# EasyEDA schematic SCH_FC-ESP32_2026-02-12.json
TITLE: Sheet_1; REV: 1.0; Date: 2026-01-28; Sheet: 1/1; Drawn By: ommulik; Company: Your Company
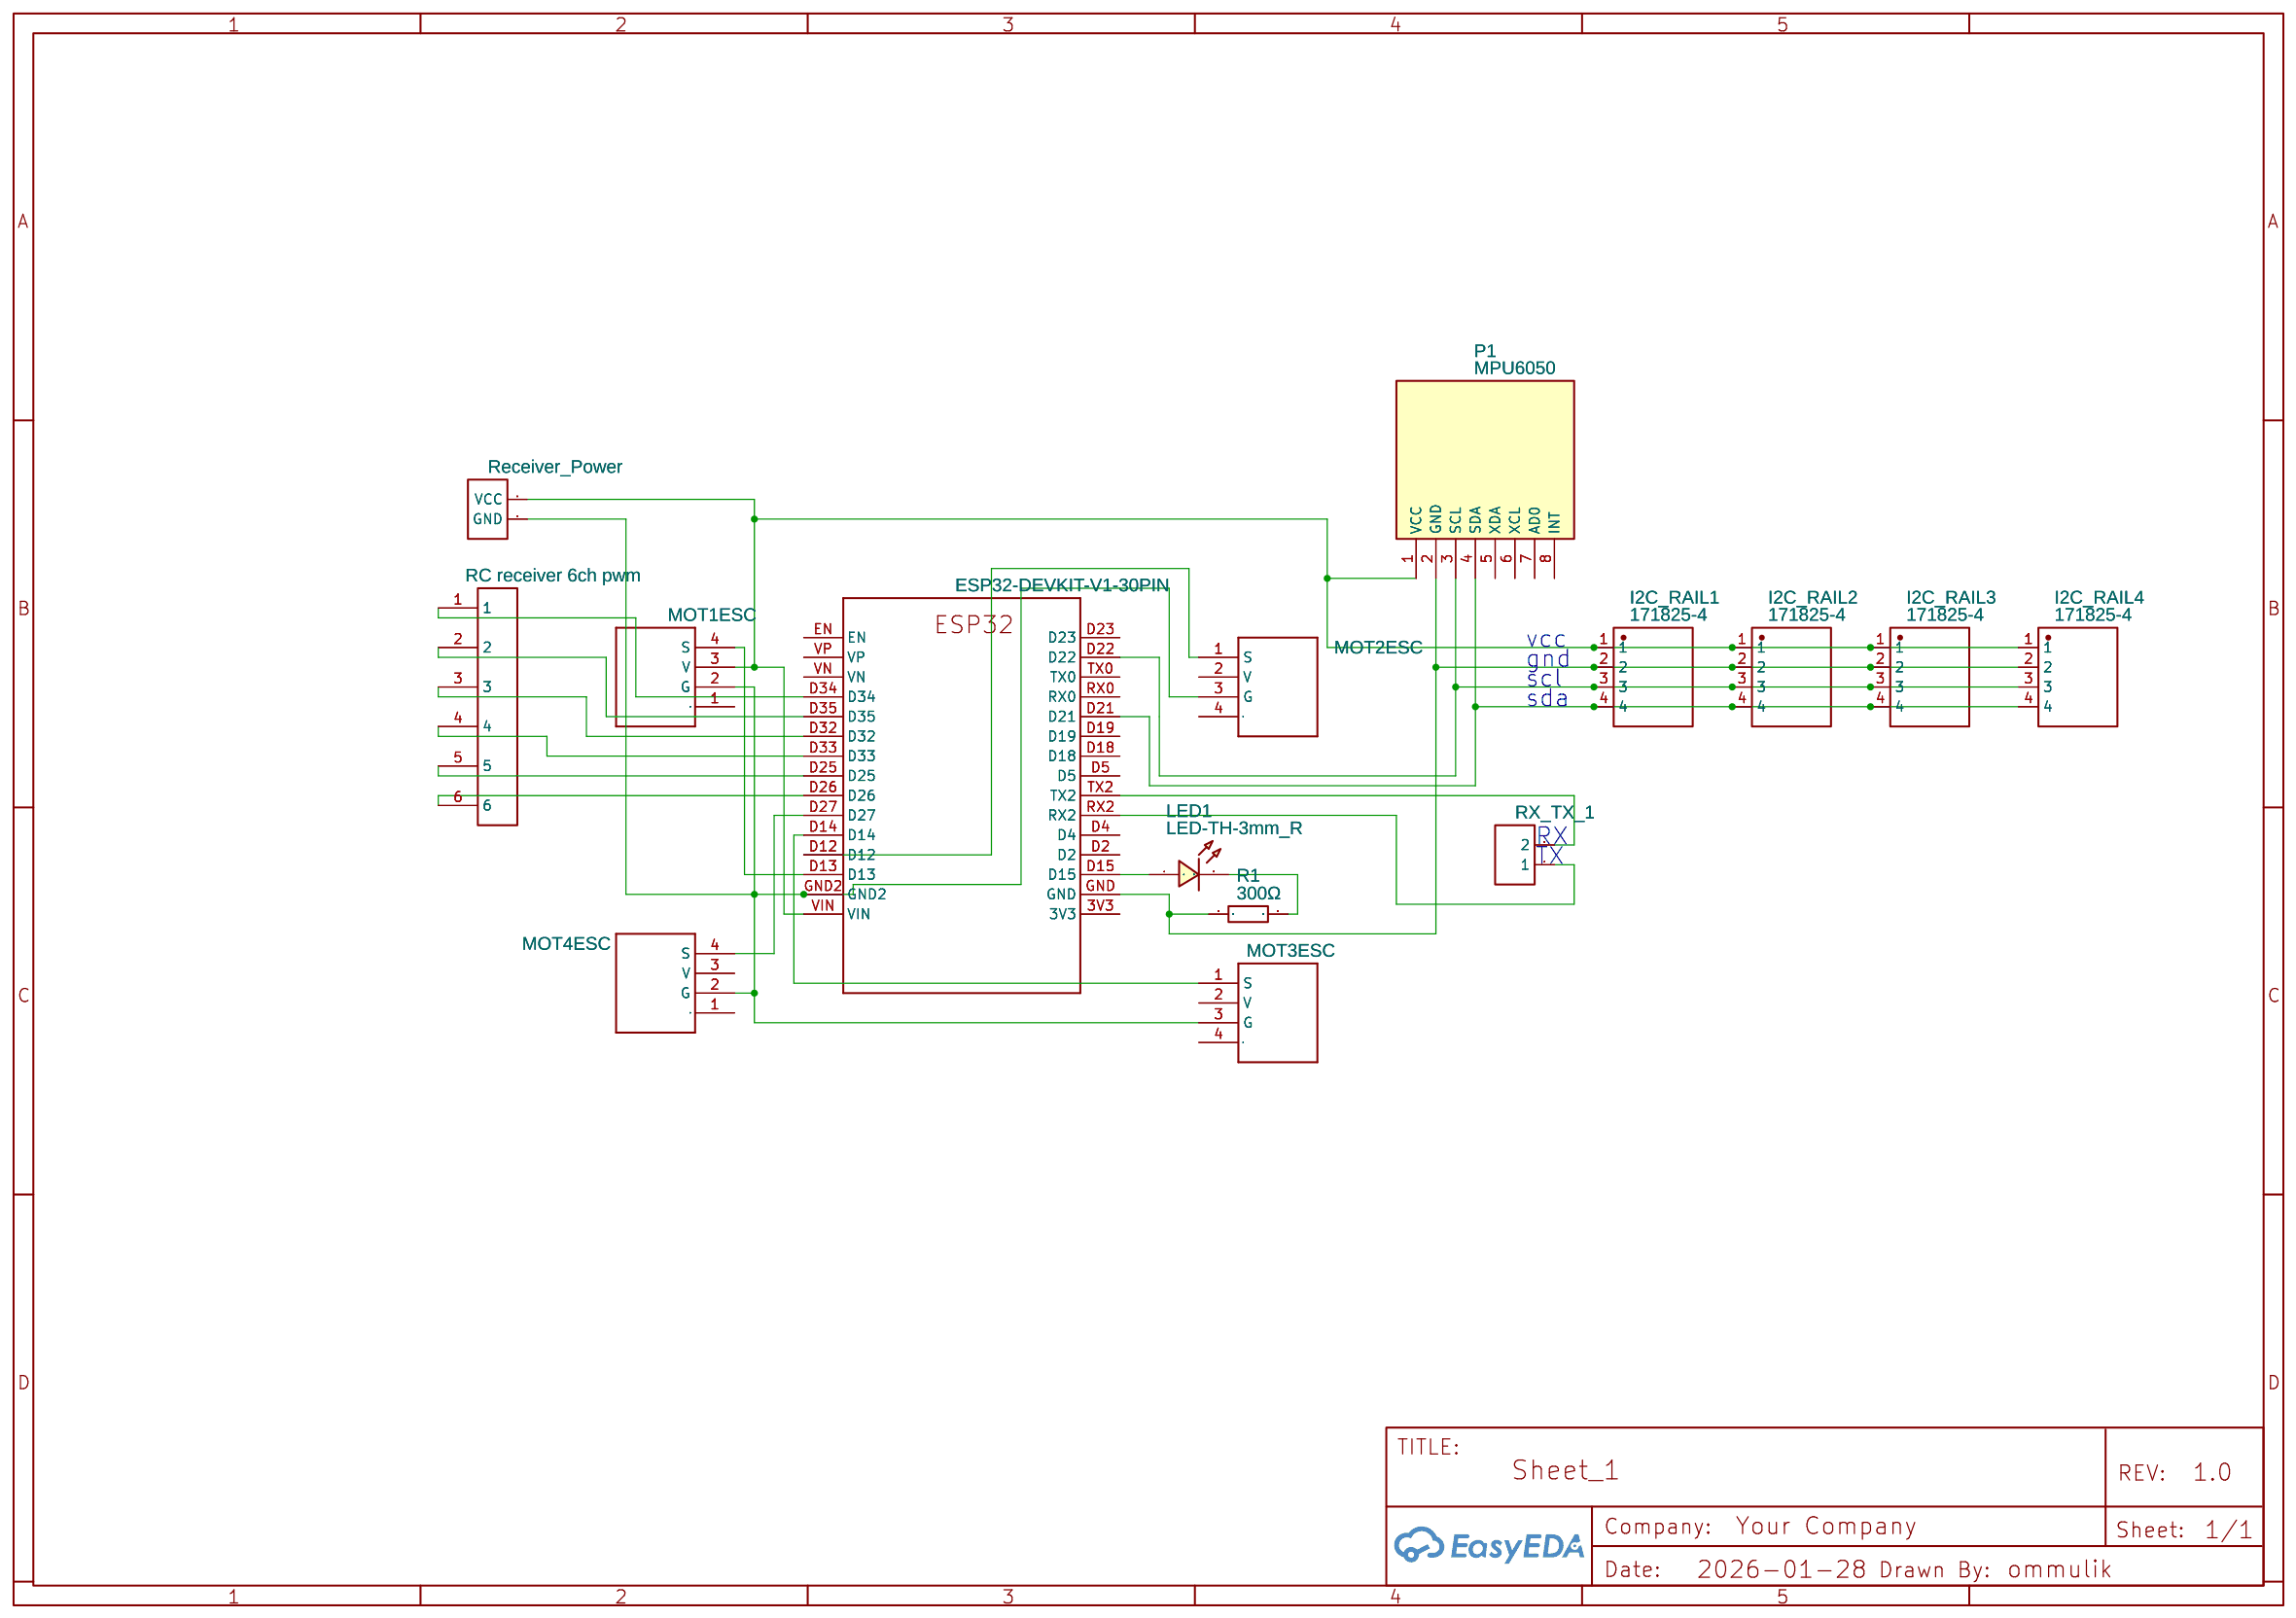
[diagram p0: schematic sheet]

## Parts
2  ESP32-DEVKIT-V1-30PIN  [ESP32-DEVKITV1_ESP32-DEVKITV1]
H1  Receiver_Power  [HDR-F-2.54_1X2]
H2  RX_TX_1  [HDR-F-2.54_1X2]
I2C_RAIL1  171825-4  [HDR-TH_4P-P2.54-D1.0]
I2C_RAIL2  171825-4  [HDR-TH_4P-P2.54-D1.0]
I2C_RAIL3  171825-4  [HDR-TH_4P-P2.54-D1.0]
I2C_RAIL4  171825-4  [HDR-TH_4P-P2.54-D1.0]
J1  MOT4ESC  [TE_171825-4]
J2  MOT1ESC  [TE_171825-4]
J3  MOT2ESC  [TE_171825-4]
J4  MOT3ESC  [TE_171825-4]
LED1  LED-TH-3mm_R  [LED-TH_BD3.0_RED]
P1  MPU6050  [MPU6050]
R1  300Ω  [RES-TH_BD2.2-L6.5-P10.50-D0.6]
S2  RC receiver 6ch pwm  [6PIN_BERG]

## Library data of the parts
2 = ESP32-DEVKIT-V1-30PIN: Contributor: susiloseptember
H1 H2 = HDR-F-2.54_1x2: Supplier Part: C49661; Supplier: LCSC; Contributor: LCEDA_Lib
I2C_RAIL1-I2C_RAIL4 = 171825-4: Contributor: LCSC; Supplier: LCSC; Supplier Part: C210162; Manufacturer: TE Connectivity(泰科电子); JLCPCB Part Class: Extended Part
J1-J4 = bluepill_scsi-rescue_171825-4-171825-4: Contributor: Uzair Patel
LED1 = LED-TH-3mm_R: Manufacturer: EVERLIGHT(台湾亿光); Manufacturer Part: 204-10SDRD/S530-A3-L; Supplier Part: C84774; Supplier: LCSC; Contributor: LCEDA_Lib
P1 = MPU6050: sourceId: 1T5FDZYC8; Contributor: 陳宇農
R1 = CF1/4W-330KΩ±5% T52: Contributor: LCSC; Supplier: LCSC; Supplier Part: C120115; Manufacturer: CCO(千志电子); JLCPCB Part Class: Extended Part
S2 = 6PIN_BERG: Contributor: Ronald Pereira

## Nets
Net-(2-D12): 2.D12 J3.1(S)
Net-(2-D13): 2.D13 J2.4(S)
Net-(2-D14): 2.D14 J4.1(S)
Net-(2-D15): 2.D15 LED1.1
Net-(2-D21): 2.D21 I2C_RAIL1.4 I2C_RAIL2.4 I2C_RAIL3.4 I2C_RAIL4.4 P1.4(SDA)
Net-(2-D22): 2.D22 I2C_RAIL1.3 I2C_RAIL2.3 I2C_RAIL3.3 I2C_RAIL4.3 P1.3(SCL)
Net-(2-D25): 2.D25 S2.5
Net-(2-D26): 2.D26 S2.6
Net-(2-D27): 2.D27 J1.4(S)
Net-(2-D32): 2.D32 S2.3
Net-(2-D33): 2.D33 S2.4
Net-(2-D34): 2.D34 S2.1
Net-(2-D35): 2.D35 S2.2
Net-(2-GND2): 2.GND2 H1.1(GND) J1.2(G) J2.2(G) J3.3(G) J4.3(G)
Net-(2-GND): 2.GND I2C_RAIL1.2 I2C_RAIL2.2 I2C_RAIL3.2 I2C_RAIL4.2 P1.2(GND) R1.2
Net-(2-RX2): 2.RX2 H2.1
Net-(2-TX2): 2.TX2 H2.2
Net-(2-VIN): 2.VIN H1.2(VCC) I2C_RAIL1.1 I2C_RAIL2.1 I2C_RAIL3.1 I2C_RAIL4.1 J2.3(V) P1.1(VCC)
Net-(LED1-2): LED1.2 R1.1

Not connected (* = marked no-connect by the designer): 2 3V3 D2 D4 D5 D18 D19 D23 EN RX0 TX0 VN VP; J1 1 3(V); J2 1; J3 2(V) 4; J4 2(V) 4; P1 5(XDA) 6(XCL) 7(AD0) 8(INT)

## Notes on the sheet
- vcc
- gnd
- scl
- sda
- RX
- TX
